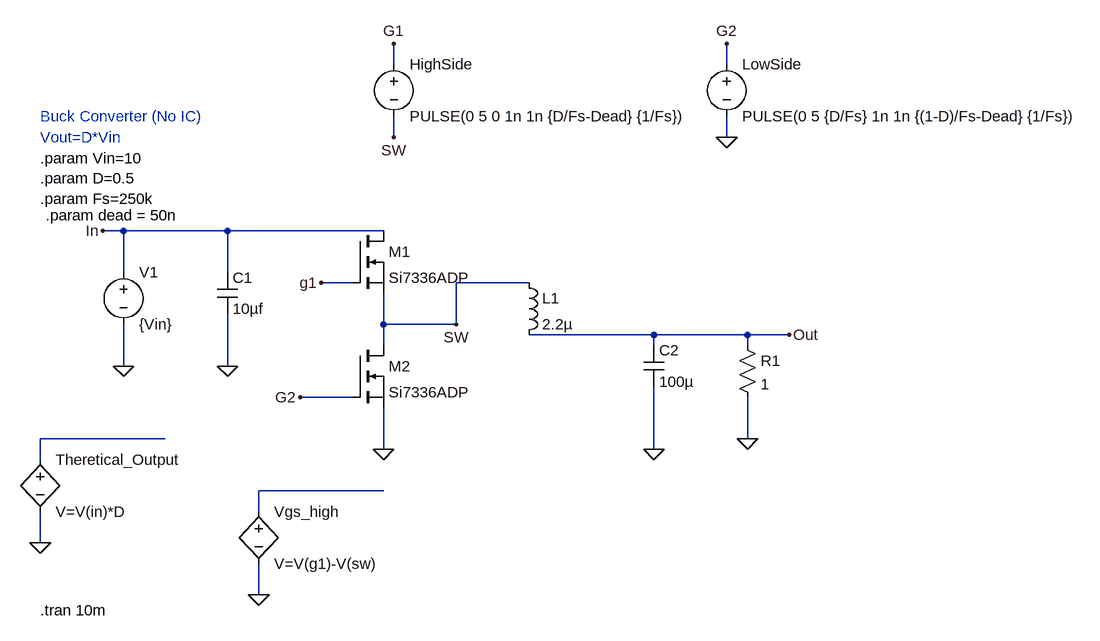
[diagram p0: schematic Buck Converter (No IC).asc]
Buck Converter (No IC).asc, the LTspice schematic file:
Version 4
SHEET 1 1672 792
WIRE 544 -64 544 -96
WIRE 1056 -64 1056 -96
WIRE 544 48 544 16
WIRE 1056 48 1056 16
WIRE 128 192 96 192
WIRE 288 192 128 192
WIRE 528 192 288 192
WIRE 128 256 128 192
WIRE 288 256 288 192
WIRE 480 272 432 272
WIRE 752 272 640 272
WIRE 528 336 528 288
WIRE 640 336 640 272
WIRE 640 336 528 336
WIRE 944 352 752 352
WIRE 1088 352 944 352
WIRE 1152 352 1088 352
WIRE 528 368 528 336
WIRE 944 368 944 352
WIRE 1088 368 1088 352
WIRE 128 400 128 336
WIRE 288 400 288 320
WIRE 480 448 400 448
WIRE 192 512 0 512
WIRE 1088 512 1088 448
WIRE 528 528 528 464
WIRE 944 528 944 432
WIRE 0 544 0 512
WIRE 528 592 336 592
WIRE 336 624 336 592
WIRE 0 672 0 624
WIRE 336 752 336 704
FLAG 128 400 0
FLAG 640 336 SW
FLAG 528 528 0
FLAG 944 528 0
FLAG 1152 352 Out
FLAG 544 -96 G1
FLAG 544 48 SW
FLAG 432 272 g1
FLAG 1056 -96 G2
FLAG 400 448 G2
FLAG 1056 48 0
FLAG 1088 512 0
FLAG 96 192 In
FLAG 288 400 0
FLAG 0 672 0
FLAG 336 752 0
SYMBOL voltage 128 240 R0
SYMATTR InstName V1
SYMATTR Value {Vin}
SYMBOL cap 272 256 R0
SYMATTR InstName C1
SYMATTR Value 10µf
SYMBOL nmos 480 192 R0
SYMATTR InstName M1
SYMATTR Value Si7336ADP
SYMBOL nmos 480 368 R0
SYMATTR InstName M2
SYMATTR Value Si7336ADP
SYMBOL ind 736 256 R0
SYMATTR InstName L1
SYMATTR Value 2.2µ
SYMBOL cap 928 368 R0
SYMATTR InstName C2
SYMATTR Value 100µ
SYMBOL res 1072 352 R0
SYMATTR InstName R1
SYMATTR Value 1
SYMBOL voltage 544 -80 R0
WINDOW 123 0 0 Left 0
WINDOW 39 0 0 Left 0
SYMATTR InstName HighSide
SYMATTR Value PULSE(0 5 0 1n 1n {D/Fs-Dead} {1/Fs})
SYMBOL voltage 1056 -80 R0
WINDOW 123 0 0 Left 0
WINDOW 39 0 0 Left 0
SYMATTR InstName LowSide
SYMATTR Value PULSE(0 5 {D/Fs} 1n 1n {(1-D)/Fs-Dead} {1/Fs})
SYMBOL bv 0 528 R0
SYMATTR InstName Theretical_Output
SYMATTR Value V=V(in)*D
SYMBOL bv 336 608 R0
SYMATTR InstName Vgs_high
SYMATTR Value V=V(g1)-V(sw)
TEXT 0 16 Left 2 ;Buck Converter (No IC)
TEXT 0 48 Left 2 ;Vout=D*Vin
TEXT 0 80 Left 2 !.param Vin=10\n.param D=0.5\n.param Fs=250k
TEXT 0 776 Left 2 !.tran 10m
TEXT 8 168 Left 2 !.param dead = 50n

The netlist it stands for:
* Buck Converter (No IC).asc
V1 In 0 {Vin}
C1 In 0 10µf
M1 In G1 SW SW Si7336ADP
M2 SW G2 0 0 Si7336ADP
L1 SW Out 2.2µ
C2 Out 0 100µ
R1 Out 0 1
V§HighSide G1 SW PULSE(0 5 0 1n 1n {D/Fs-Dead} {1/Fs})
V§LowSide G2 0 PULSE(0 5 {D/Fs} 1n 1n {(1-D)/Fs-Dead} {1/Fs})
B§Theretical_Output N001 0 V=V(in)*D
B§Vgs_high N002 0 V=V(g1)-V(sw)
.model NMOS NMOS
.model PMOS PMOS
.lib standard.mos
* Buck Converter (No IC)
* Vout=D*Vin
.param Vin=10
.param D=0.5
.param Fs=250k
.tran 10m
.param dead = 50n
.backanno
.end